# EAGLE schematic Precharge_2019_Test (EAGLE 8.7.0)

## Sheet 1 of 2: Connectors
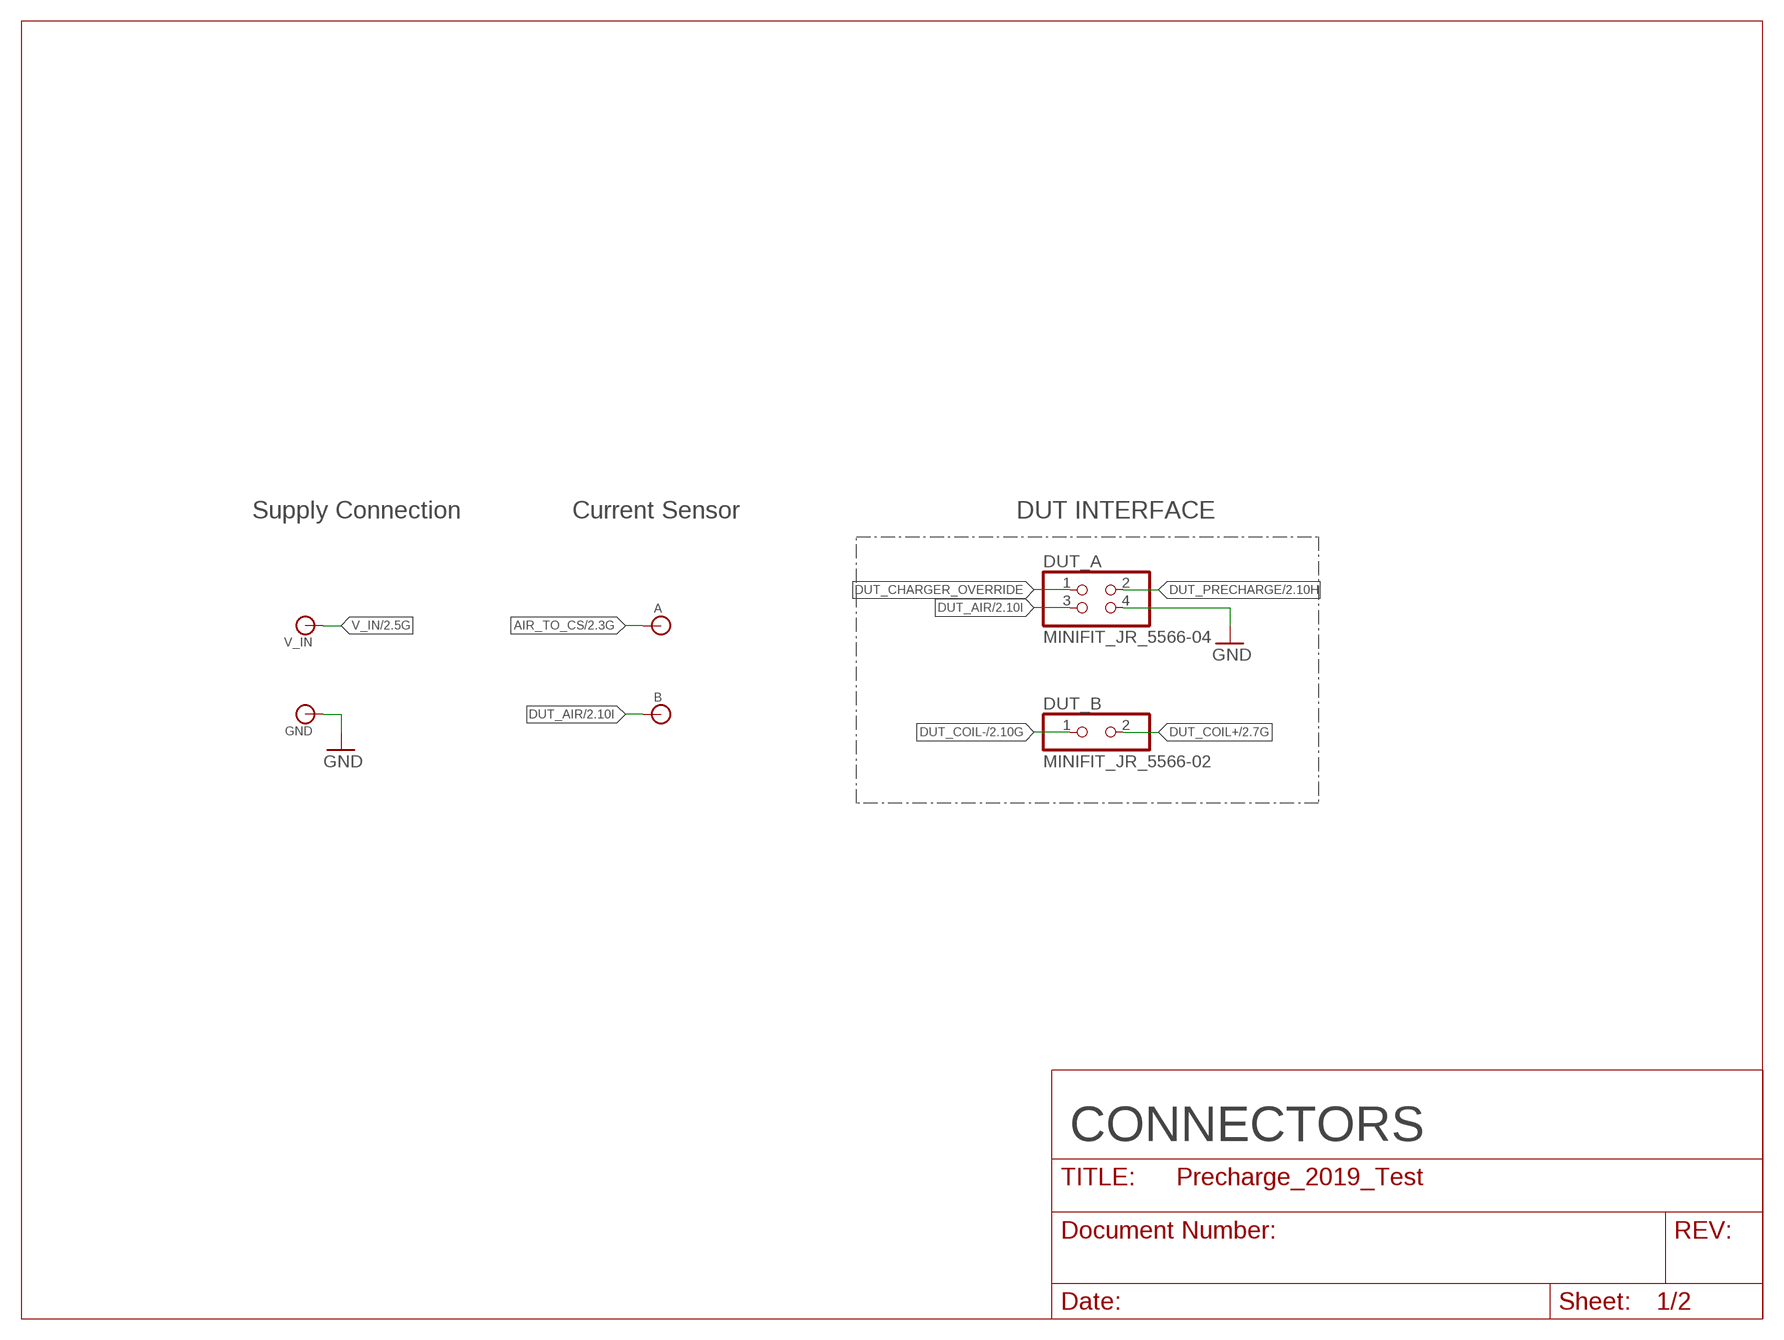
[diagram p0: schematic, sheet 1]

### Parts
A  BANANA_CONN  [BANANA_CONN]
B  BANANA_CONN  [BANANA_CONN]
DUT_A  MINIFIT_JR_5566-04  [MINIFIT_JR_5566-04]
DUT_B  MINIFIT_JR_5566-02  [MINIFIT_JR_5566-02]
GND  BANANA_CONN  [BANANA_CONN]
V_IN  BANANA_CONN  [BANANA_CONN]

### Nets
AIR_TO_CS: A.P$1 ; also sheet 2
DUT_AIR: B.P$1 DUT_A.3 ; also sheet 2
DUT_CHARGER_OVERRIDE: DUT_A.1
DUT_COIL+: DUT_B.2 ; also sheet 2
DUT_COIL-: DUT_B.1 ; also sheet 2
DUT_PRECHARGE: DUT_A.2 ; also sheet 2
GND: DUT_A.4 GND.P$1 ; also sheet 2
V_IN: V_IN.P$1 ; also sheet 2

### Notes on the sheet
- Supply Connection | Current Sensor | DUT INTERFACE
- CONNECTORS

## Sheet 2 of 2: Stimuli
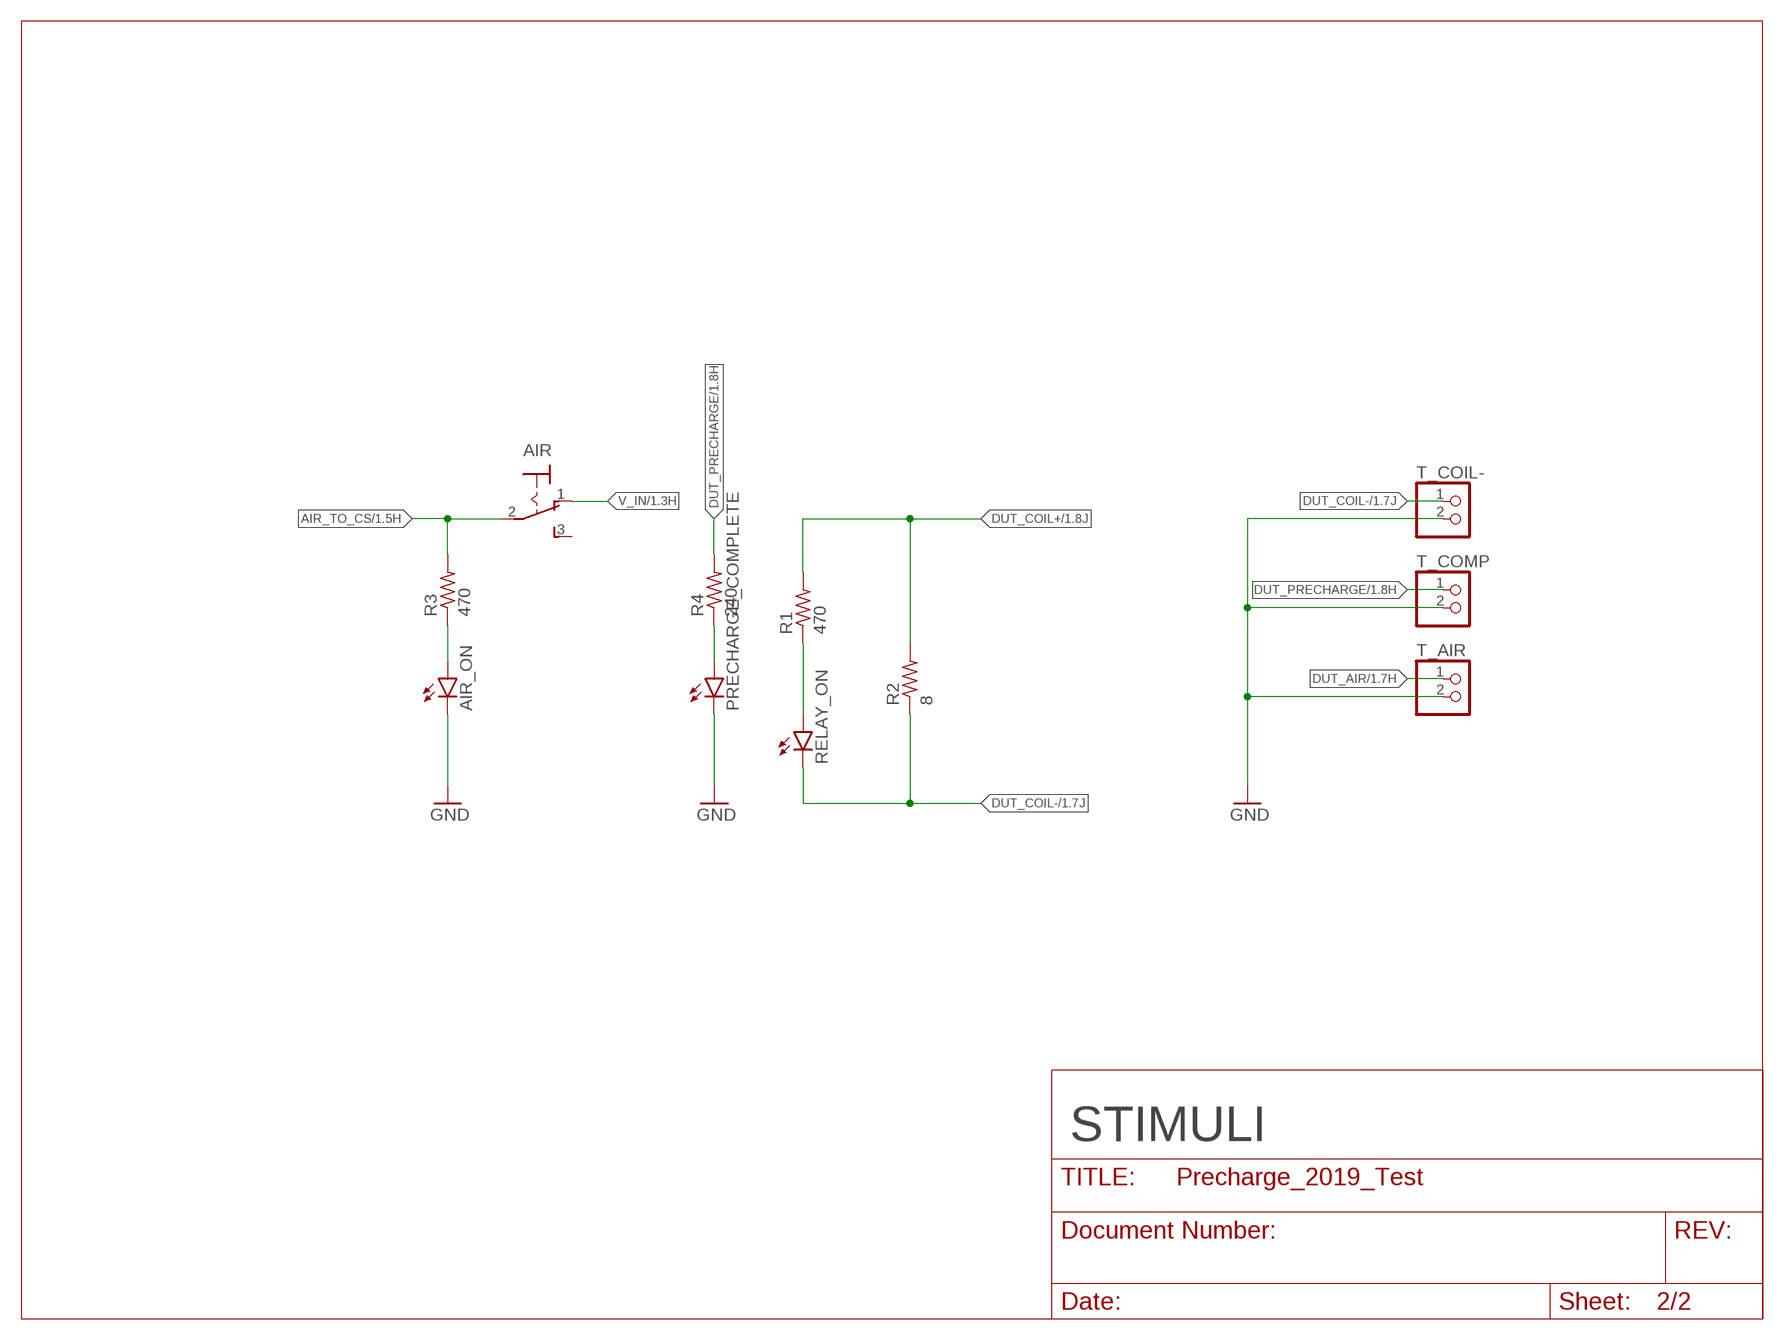
[diagram p1: schematic, sheet 2]

### Parts
AIR  320-916  [320-916]
AIR_ON  LED0603  [LED-0603]
PRECHARGE_COMPLETE  LED0603  [LED-0603]
R1  470  R-US_R0603  [R0603]
R2  8  R-US_R0603  [R0603]
R3  470  R-US_R0603  [R0603]
R4  240  R-US_R0603  [R0603]
RELAY_ON  LED0603  [LED-0603]
T_AIR  PINHD-1X2  [1X02]
T_COIL-  PINHD-1X2  [1X02]
T_COMP  PINHD-1X2  [1X02]

### Nets
AIR_TO_CS: AIR.2(P) R3.2 ; also sheet 1
DUT_AIR: T_AIR.1 ; also sheet 1
DUT_COIL+: R1.2 R2.2 ; also sheet 1
DUT_COIL-: R2.1 RELAY_ON.C T_COIL-.1 ; also sheet 1
DUT_PRECHARGE: R4.2 T_COMP.1 ; also sheet 1
GND: AIR_ON.C PRECHARGE_COMPLETE.C T_AIR.2 T_COIL-.2 T_COMP.2 ; also sheet 1
N$1: AIR_ON.A R3.1
N$2: R1.1 RELAY_ON.A
N$3: PRECHARGE_COMPLETE.A R4.1
V_IN: AIR.1(O) ; also sheet 1
Unconnected: AIR.3(S)

### Notes on the sheet
- STIMULI

## Library data of the parts
A B GND V_IN = SparkFun-Connectors:BANANA_CONN: Through-hole banana jack
AIR = switch:320-916: TOGGLE SWITCH distributor RS Components
AIR_ON PRECHARGE_COMPLETE RELAY_ON = SparkFun-LED:LED: LEDs Standard schematic elements and footprints for 5mm, 3mm, 1206, and 0603 sized LEDs. 5mm - Spark Fun Electronics SKU : COM-00529 (and others)
DUT_A = Display_Custom:MINIFIT_JR_5566-04: Molex Minifit JR 5566-04 Vertical 4 position headder https://www.molex.com/pdm_docs/sd/039293026_sd.pdf
DUT_B = Display_Custom:MINIFIT_JR_5566-02: Molex Minifit JR 5566-02 Vertical 2 position headder https://www.molex.com/pdm_docs/sd/039293026_sd.pdf
R1-R4 = rcl:R-US_: RESISTOR, American symbol; SPICEPREFIX: R
T_AIR T_COIL- T_COMP = Headers_IFE:PINHD-1X2: PIN HEADER